# Altium schematic sheet Sheet_1_2026-03-24.schdoc
size 159 x 269 mm
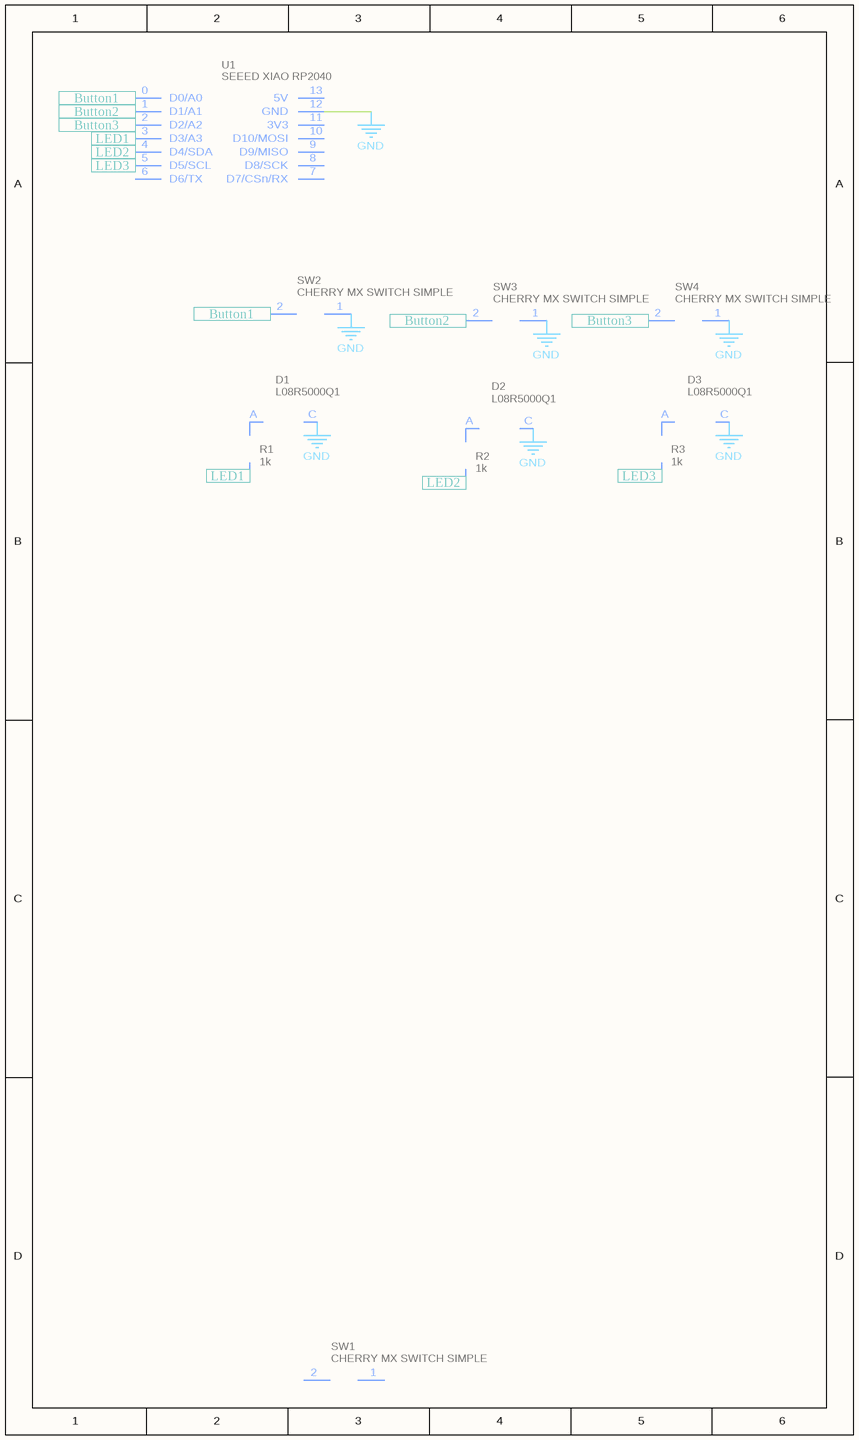
[diagram p0: Sheet_1_2026-03-24.schdoc]

## Parts
D1  L08R5000Q1  [LEDRD254W57D500H1070]
D2  L08R5000Q1  [LEDRD254W57D500H1070]
D3  L08R5000Q1  [LEDRD254W57D500H1070]
R1  1k  [R0603]
R2  1k  [R0603]
R3  1k  [R0603]
SW1  CHERRY MX SWITCH SIMPLE  [CHERRY_MX_1U_SQ]
SW2  CHERRY MX SWITCH SIMPLE  [CHERRY_MX_1U_SQ]
SW3  CHERRY MX SWITCH SIMPLE  [CHERRY_MX_1U_SQ]
SW4  CHERRY MX SWITCH SIMPLE  [CHERRY_MX_1U_SQ]
U1  SEEED XIAO RP2040  [XIAO RP2040 SMT]

## Ports
Button1 (in), Button2 (in), Button3 (in), LED1 (in), LED2 (in), LED3 (in)

## Nets
GND: D1.C D2.C D3.C SW2.1 SW3.1 SW4.1 U1.12(GND)
Button1: SW2.2 U1.0(D0/A0) ; port Button1
Button2: SW3.2 U1.1(D1/A1) ; port Button2
Button3: SW4.2 U1.2(D2/A2) ; port Button3
LED1: R1.1 U1.3(D3/A3) ; port LED1
LED2: R2.1 U1.4(D4/SDA) ; port LED2
LED3: R3.1 U1.5(D5/SCL) ; port LED3
NetD1_A: D1.A R1.2
NetD2_A: D2.A R2.2
NetD3_A: D3.A R3.2

Not connected (* = marked no-connect by the designer): SW1 1 2; U1 6(D6/TX) 7(D7/CSn/RX) 8(D8/SCK) 9(D9/MISO) 10(D10/MOSI) 11(3V3) 13(5V)

## Library data of the parts
D1-D3 = L08R5000Q1: Contributor: aleca; spicePre: D; spiceSymbolName: L08R5000Q1
R1-R3 = 1k: nameAlias: Value(Ω); Contributor: LCEDA_Lib; spicePre: R; spiceSymbolName: R_0603_EU
SW1-SW4 = CHERRY MX SWITCH SIMPLE: Contributor: geocipher; Supplier: Mouser; spicePre: S; spiceSymbolName: CHERRY MX SWITCH SIMPLE
U1 = SEEED XIAO RP2040: Contributor: Jostein Løwer; Supplier Part: 713-102010428; Supplier: Mouser; link: https://no.mouser.com/ProductDetail/Seeed-Studio/102010428?qs=Znm5pLBrcAJ75FCbdxzDHQ%3D%3D; spicePre: U; spiceSymbolName: SEEED XIAO RP2040